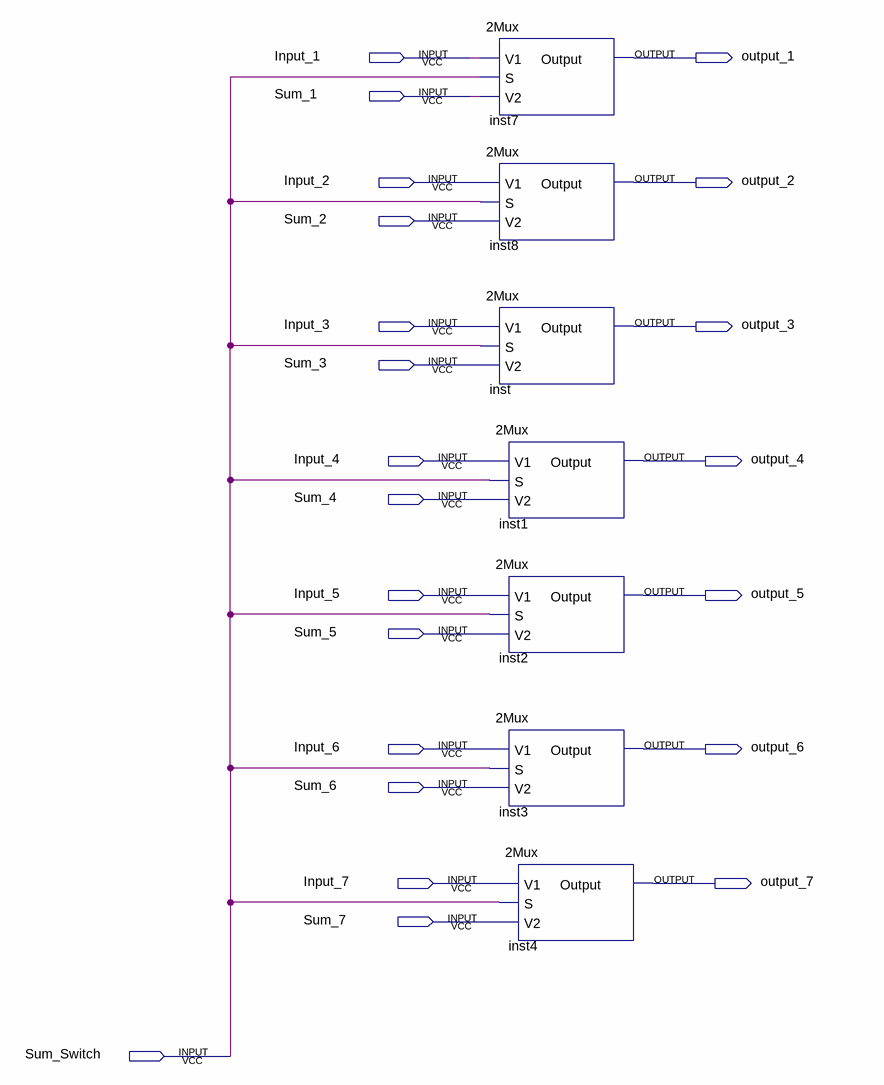
[diagram p0: schematic sheet]
// Quartus schematic 7mux.bdf as structural Verilog: 7 symbols, 22 pins
module \7mux  (
  input  Input_1,
  input  Sum_1,
  input  Input_2,
  input  Sum_2,
  input  Input_3,
  input  Sum_3,
  input  Input_4,
  input  Sum_4,
  input  Input_5,
  input  Sum_5,
  input  Input_6,
  input  Sum_6,
  input  Input_7,
  input  Sum_7,
  input  Sum_Switch,
  output output_1,
  output output_2,
  output output_3,
  output output_4,
  output output_5,
  output output_6,
  output output_7
);

  \2Mux  inst7 (.V1(Input_1), .S(Sum_Switch), .V2(Sum_1), .Output(output_1));
  \2Mux  inst8 (.V1(Input_2), .S(Sum_Switch), .V2(Sum_2), .Output(output_2));
  \2Mux  inst (.V1(Input_3), .S(Sum_Switch), .V2(Sum_3), .Output(output_3));
  \2Mux  inst1 (.V1(Input_4), .S(Sum_Switch), .V2(Sum_4), .Output(output_4));
  \2Mux  inst2 (.V1(Input_5), .S(Sum_Switch), .V2(Sum_5), .Output(output_5));
  \2Mux  inst3 (.V1(Input_6), .S(Sum_Switch), .V2(Sum_6), .Output(output_6));
  \2Mux  inst4 (.V1(Input_7), .S(Sum_Switch), .V2(Sum_7), .Output(output_7));
endmodule
